# Altium project Invertor 24-380V.PrjPcb
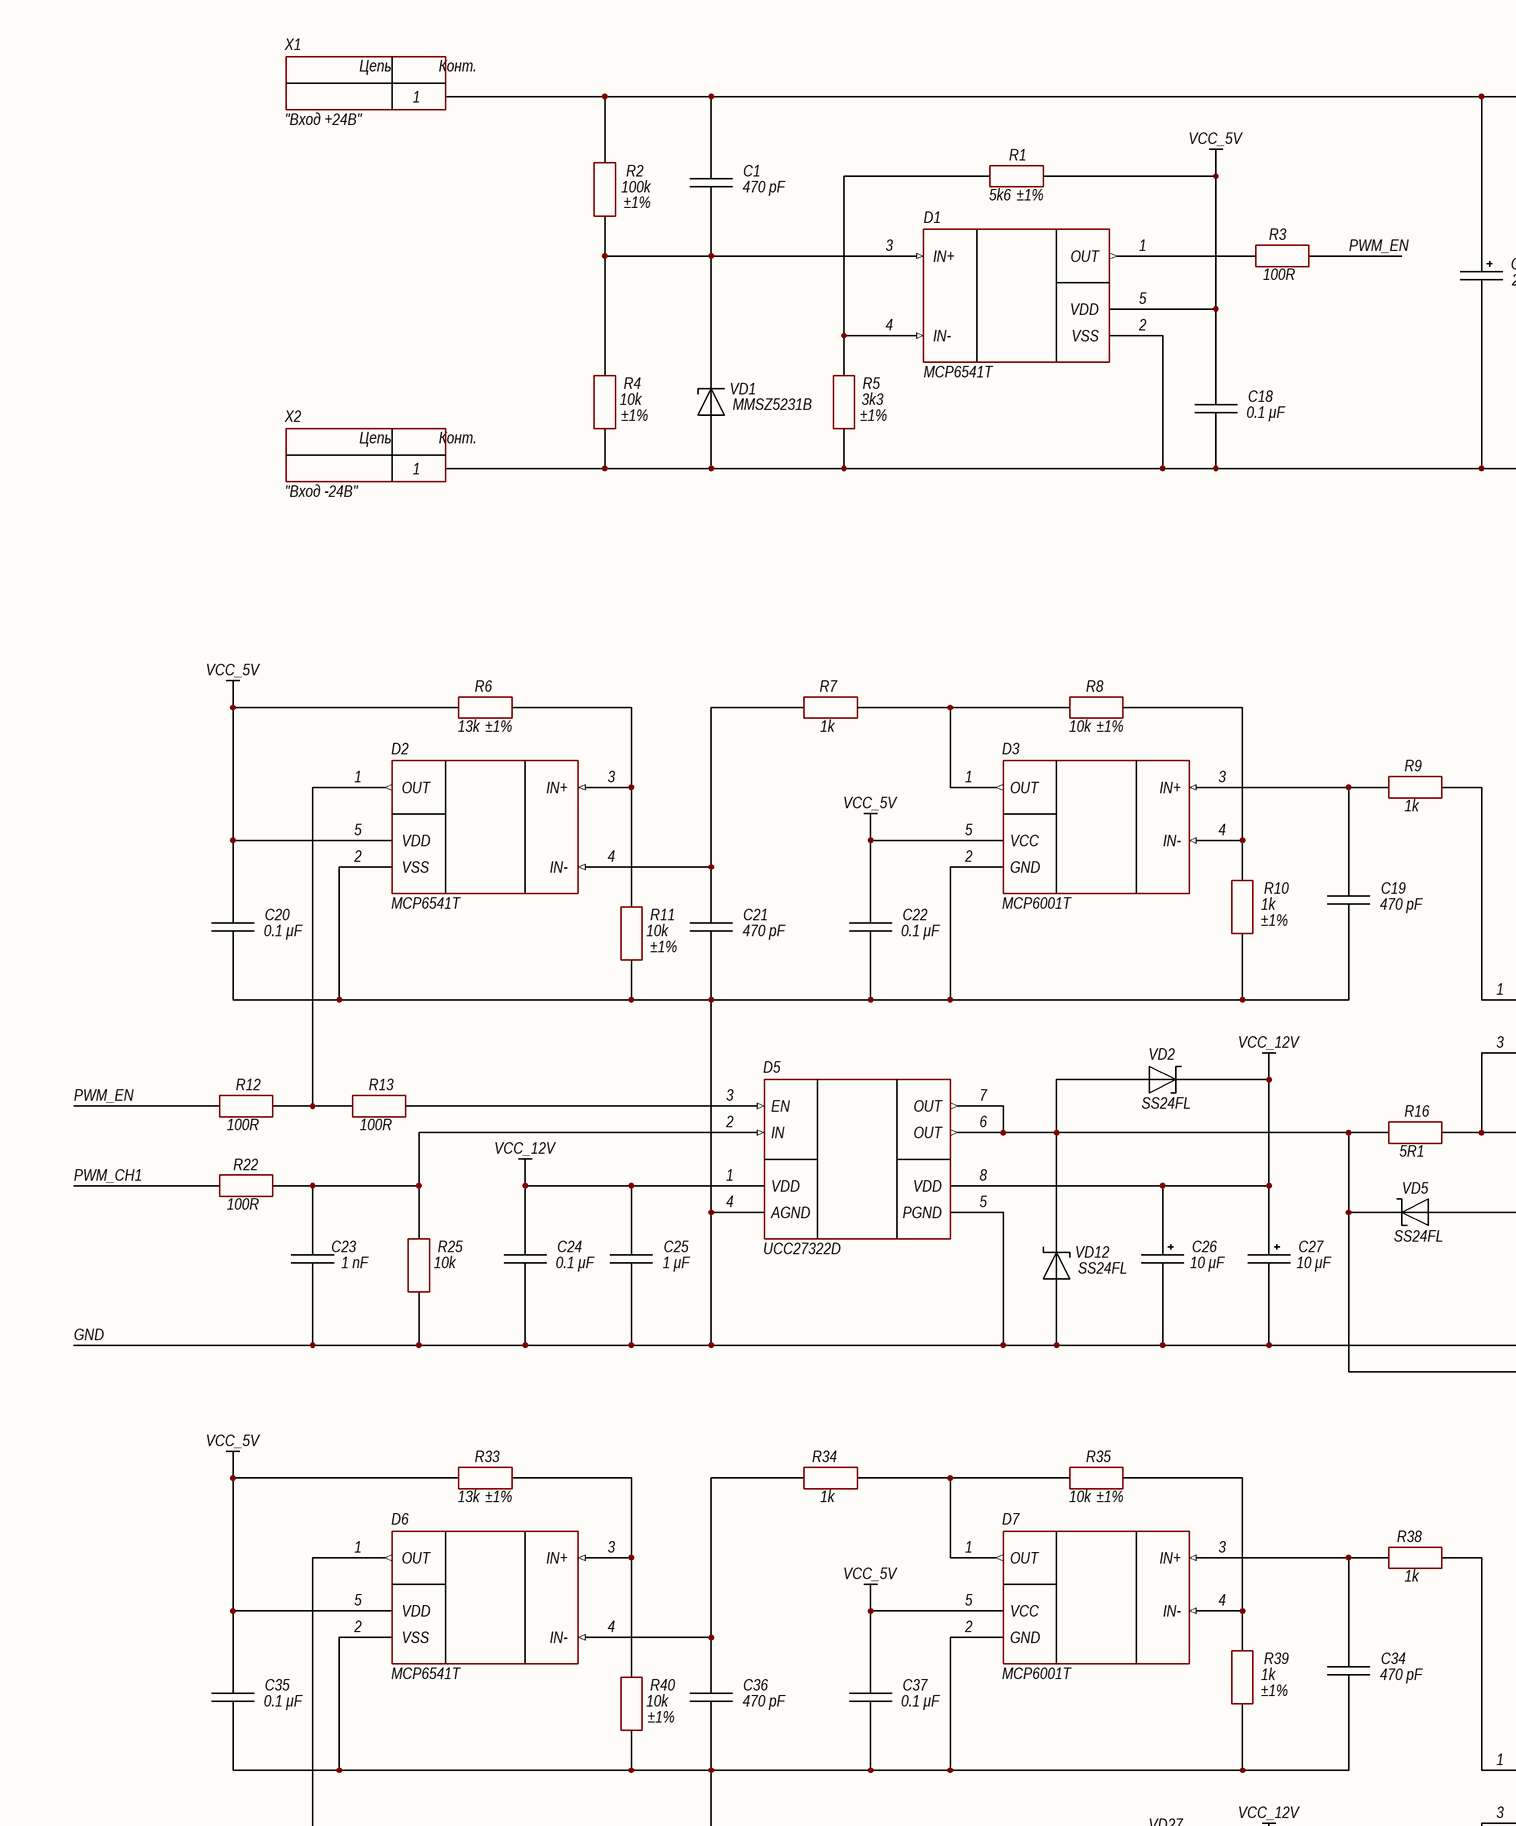
[diagram p0: Page 1.SchDoc, top left]
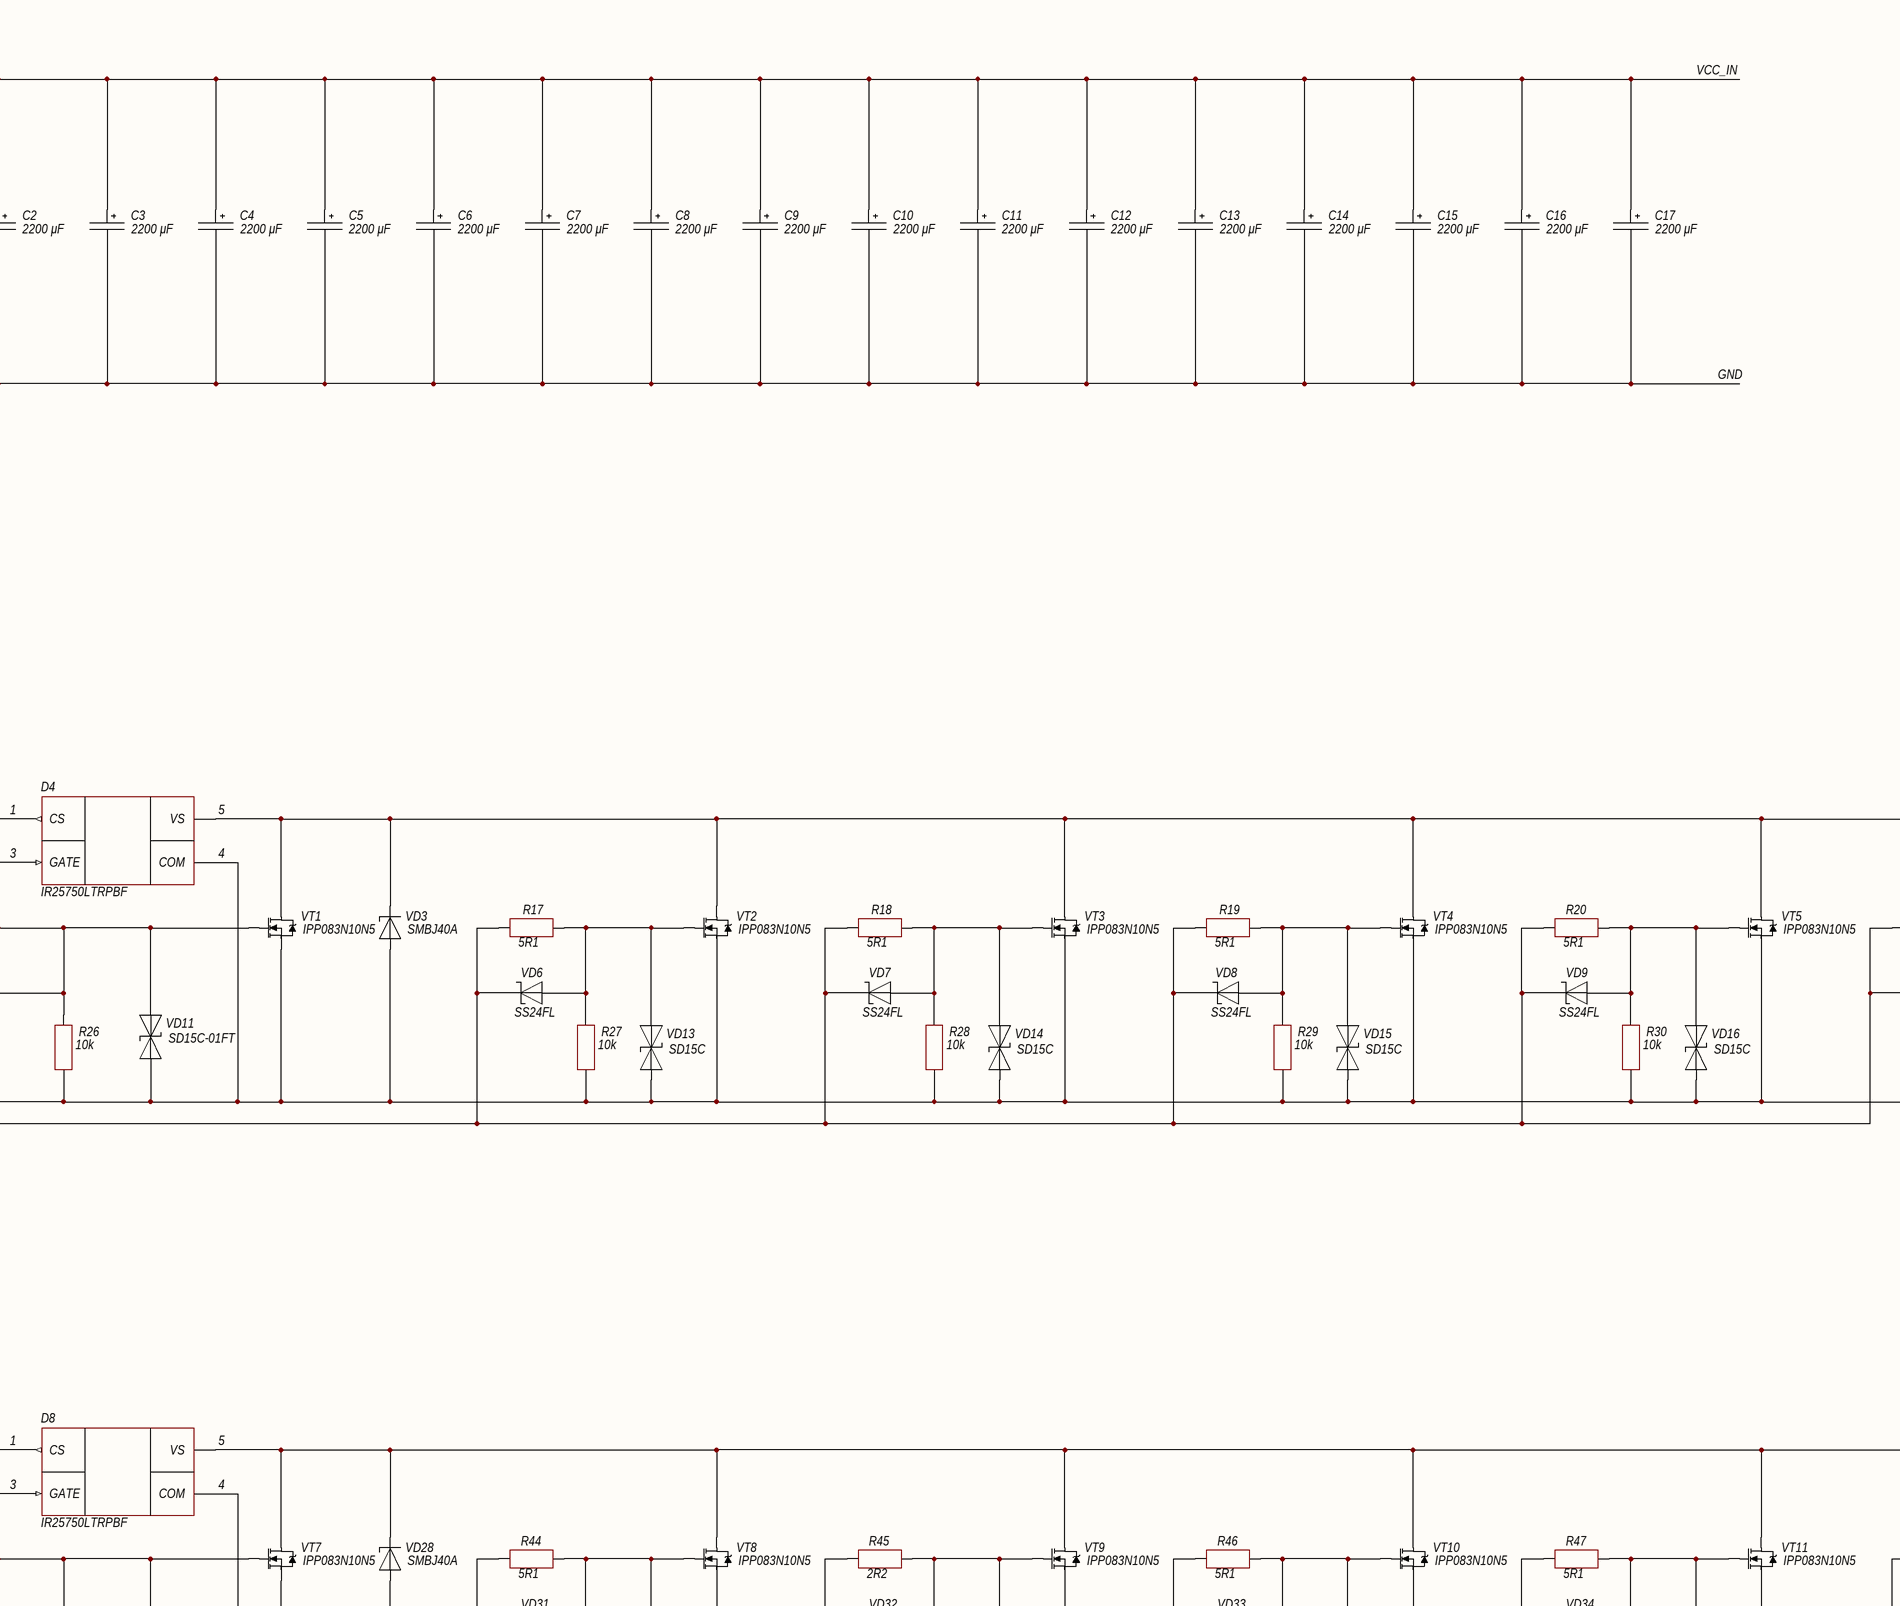
[diagram p1: Page 1.SchDoc, top middle]
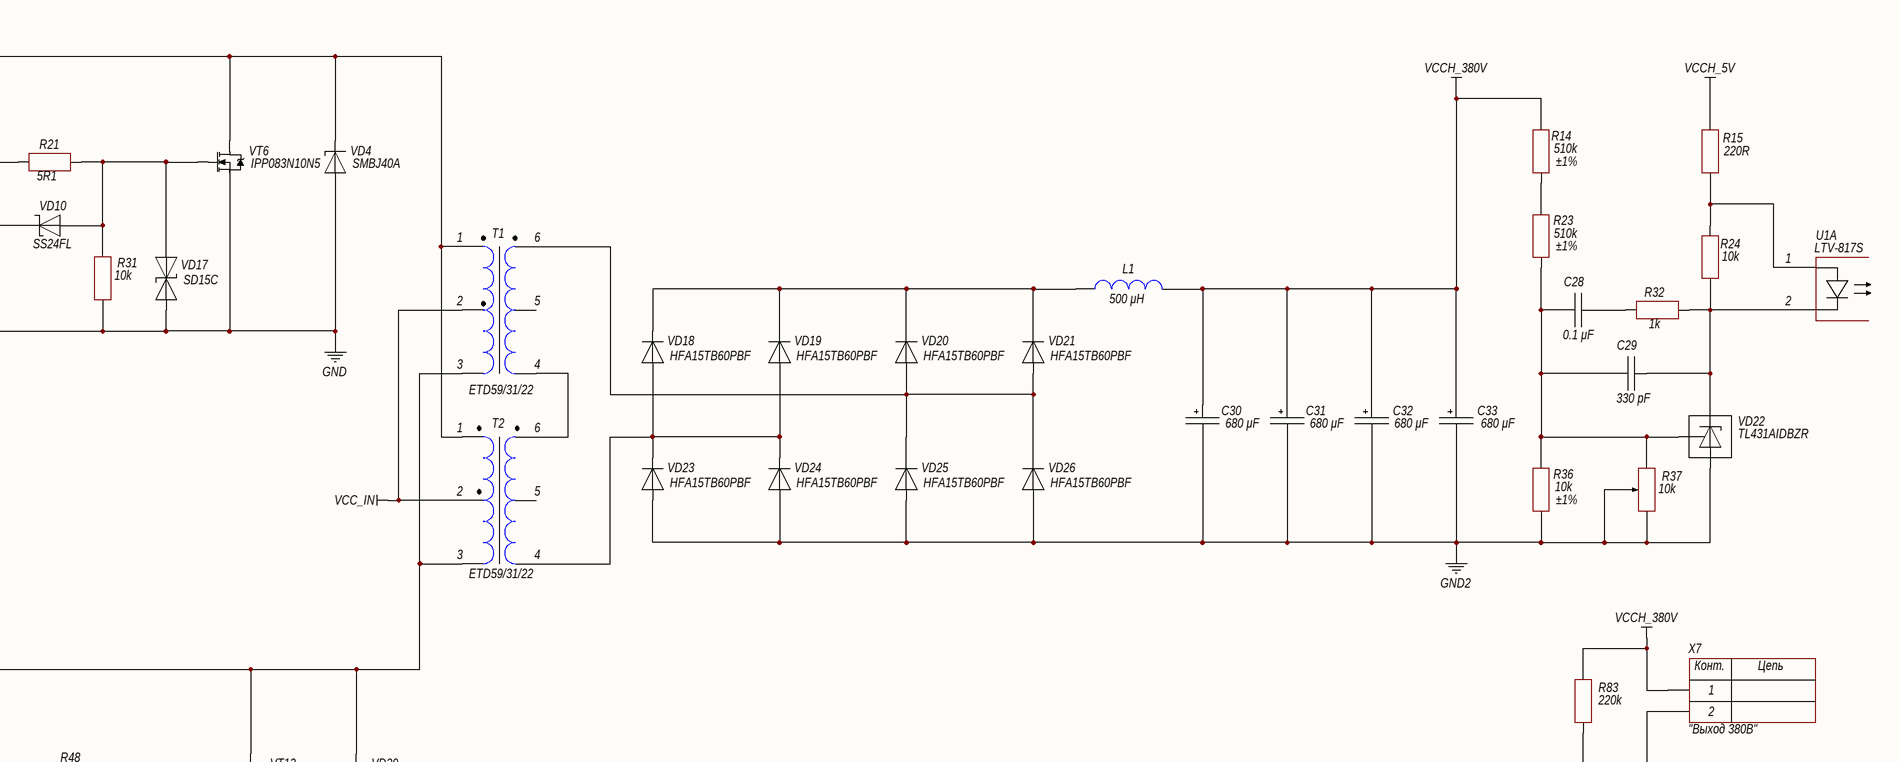
[diagram p2: Page 1.SchDoc, top right]
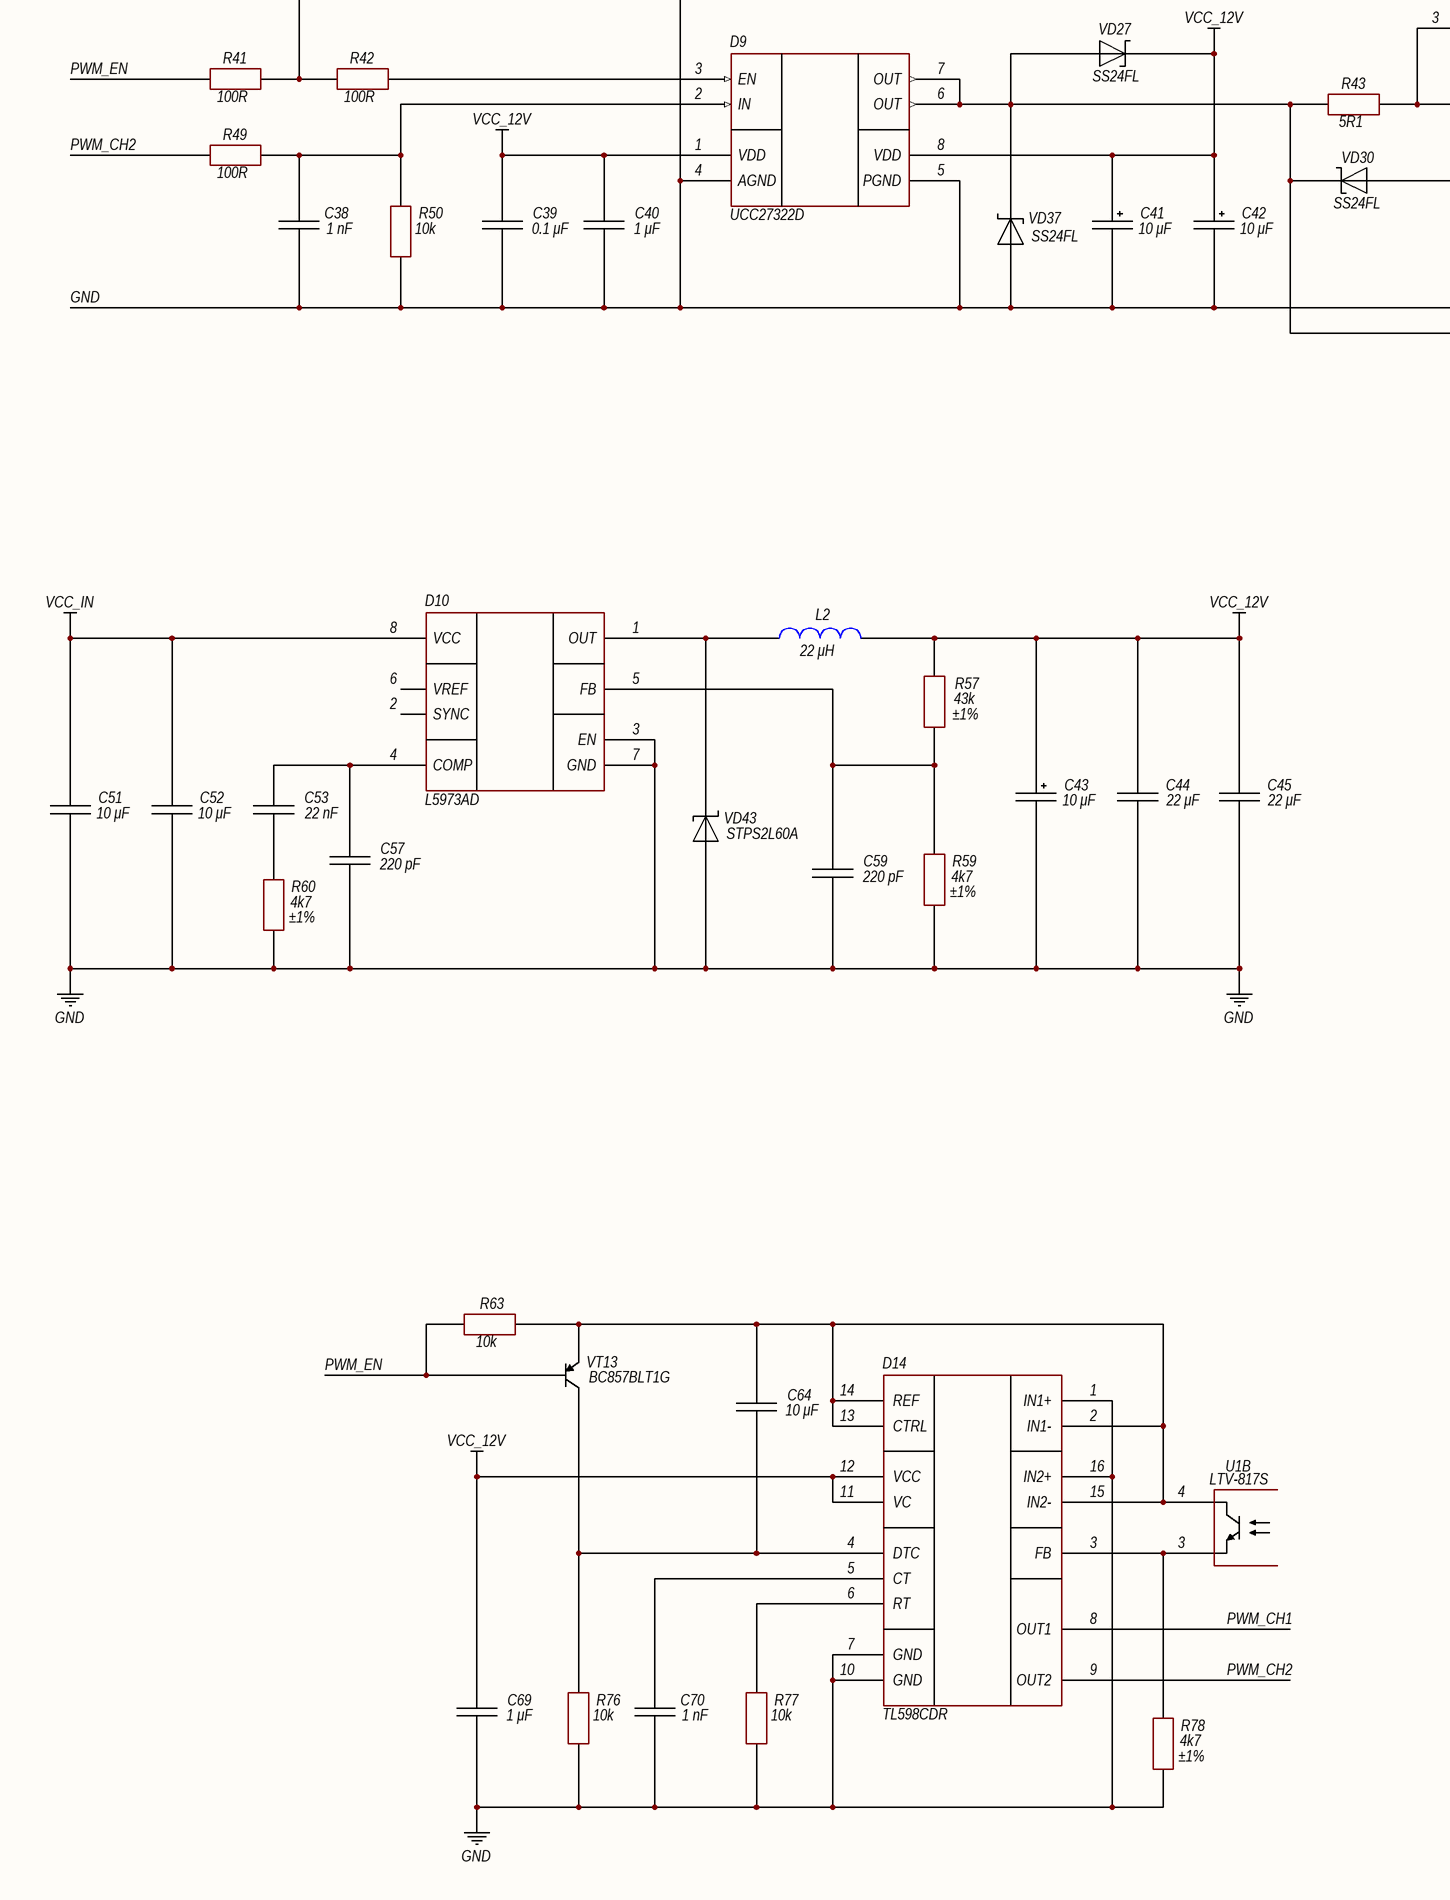
[diagram p3: Page 1.SchDoc, bottom left]
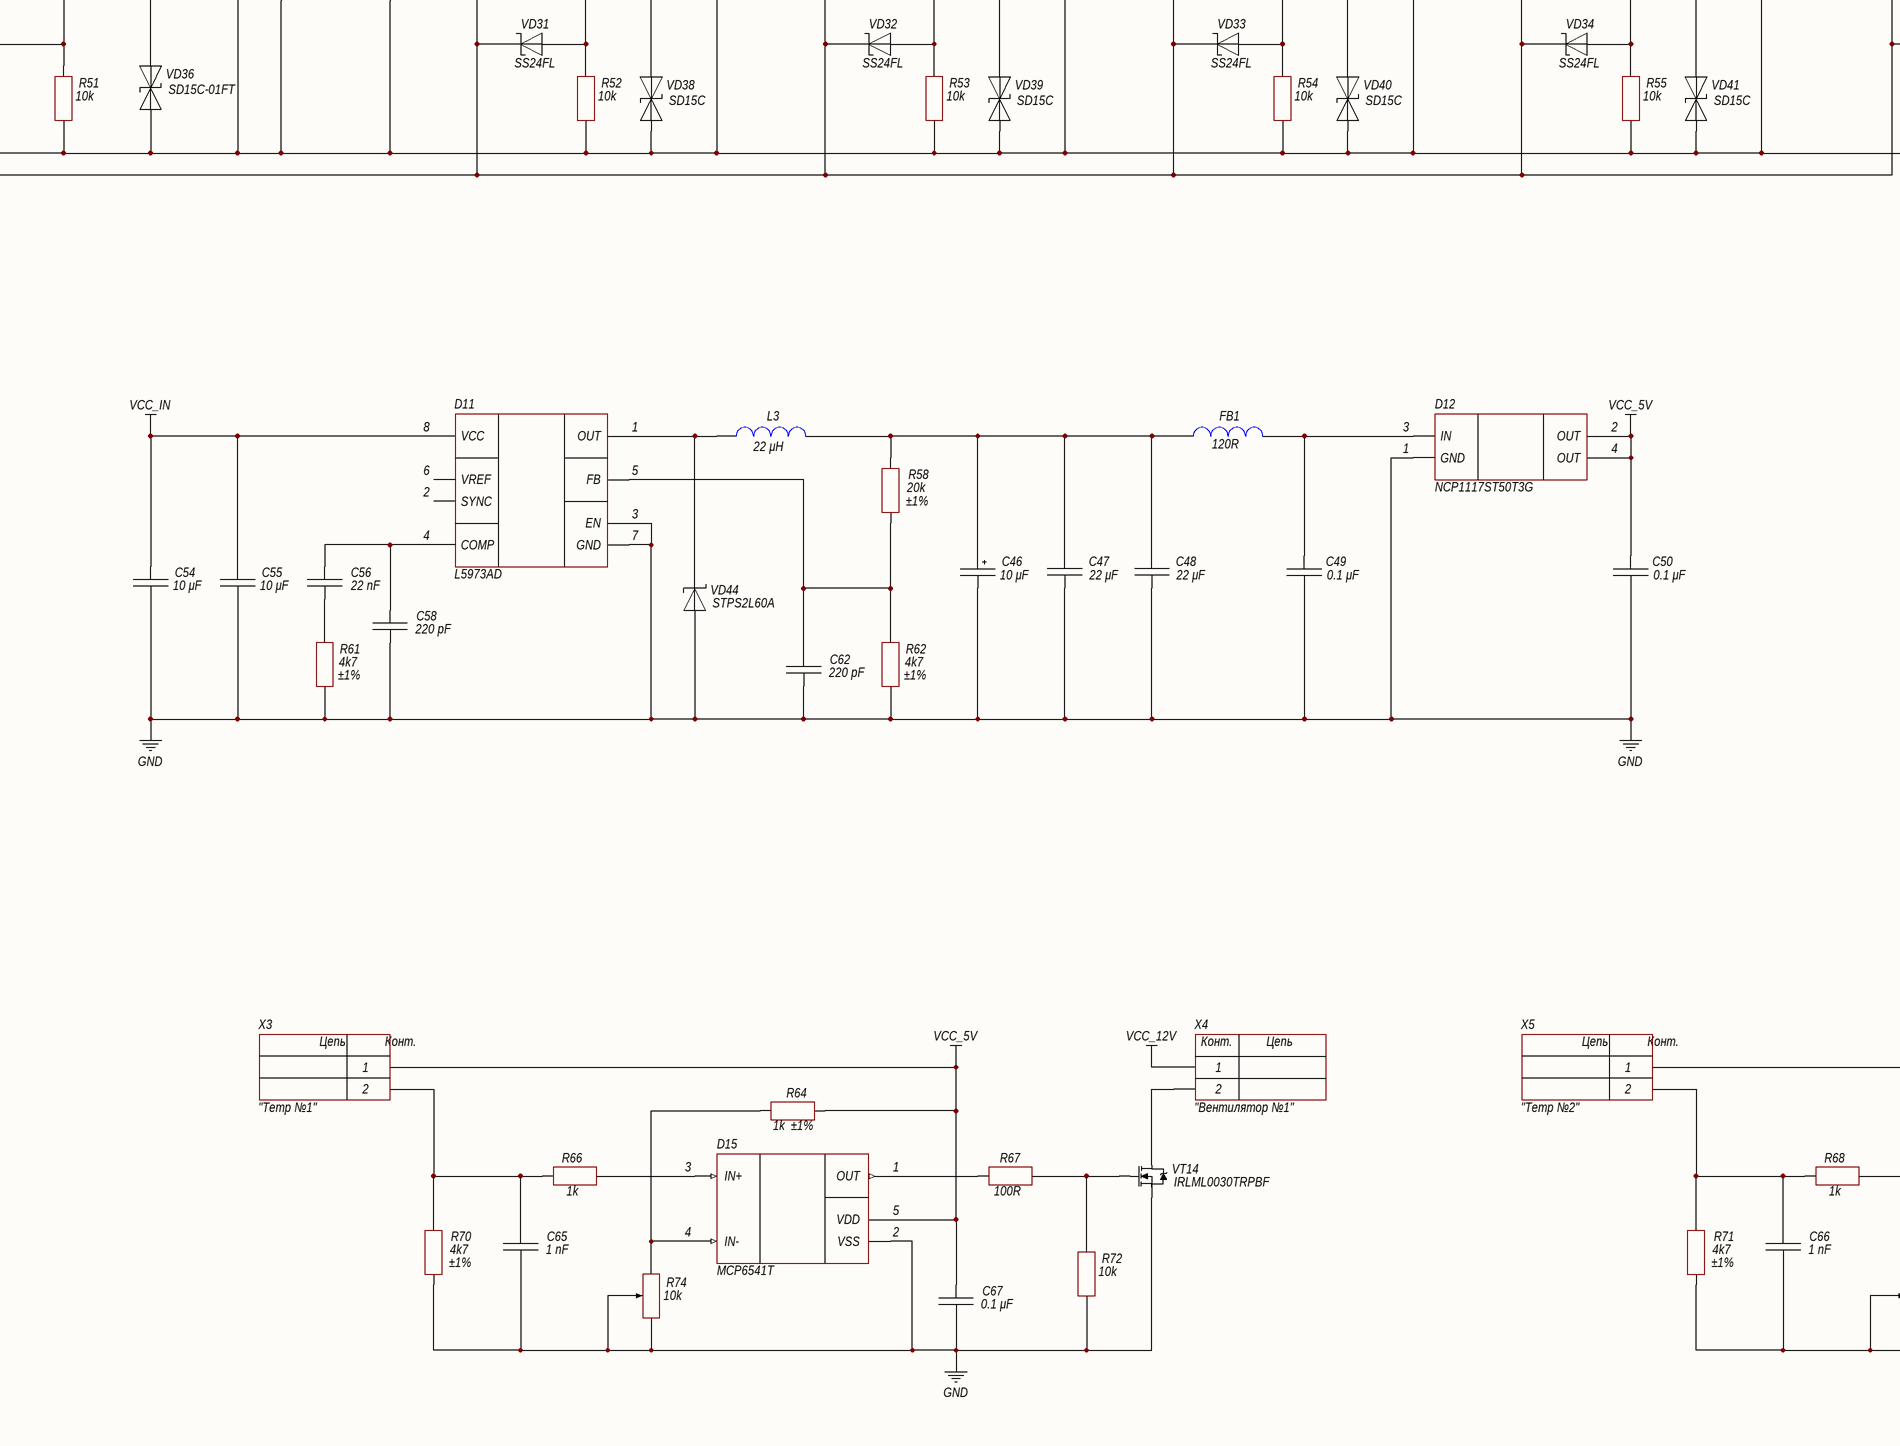
[diagram p4: Page 1.SchDoc, bottom middle]
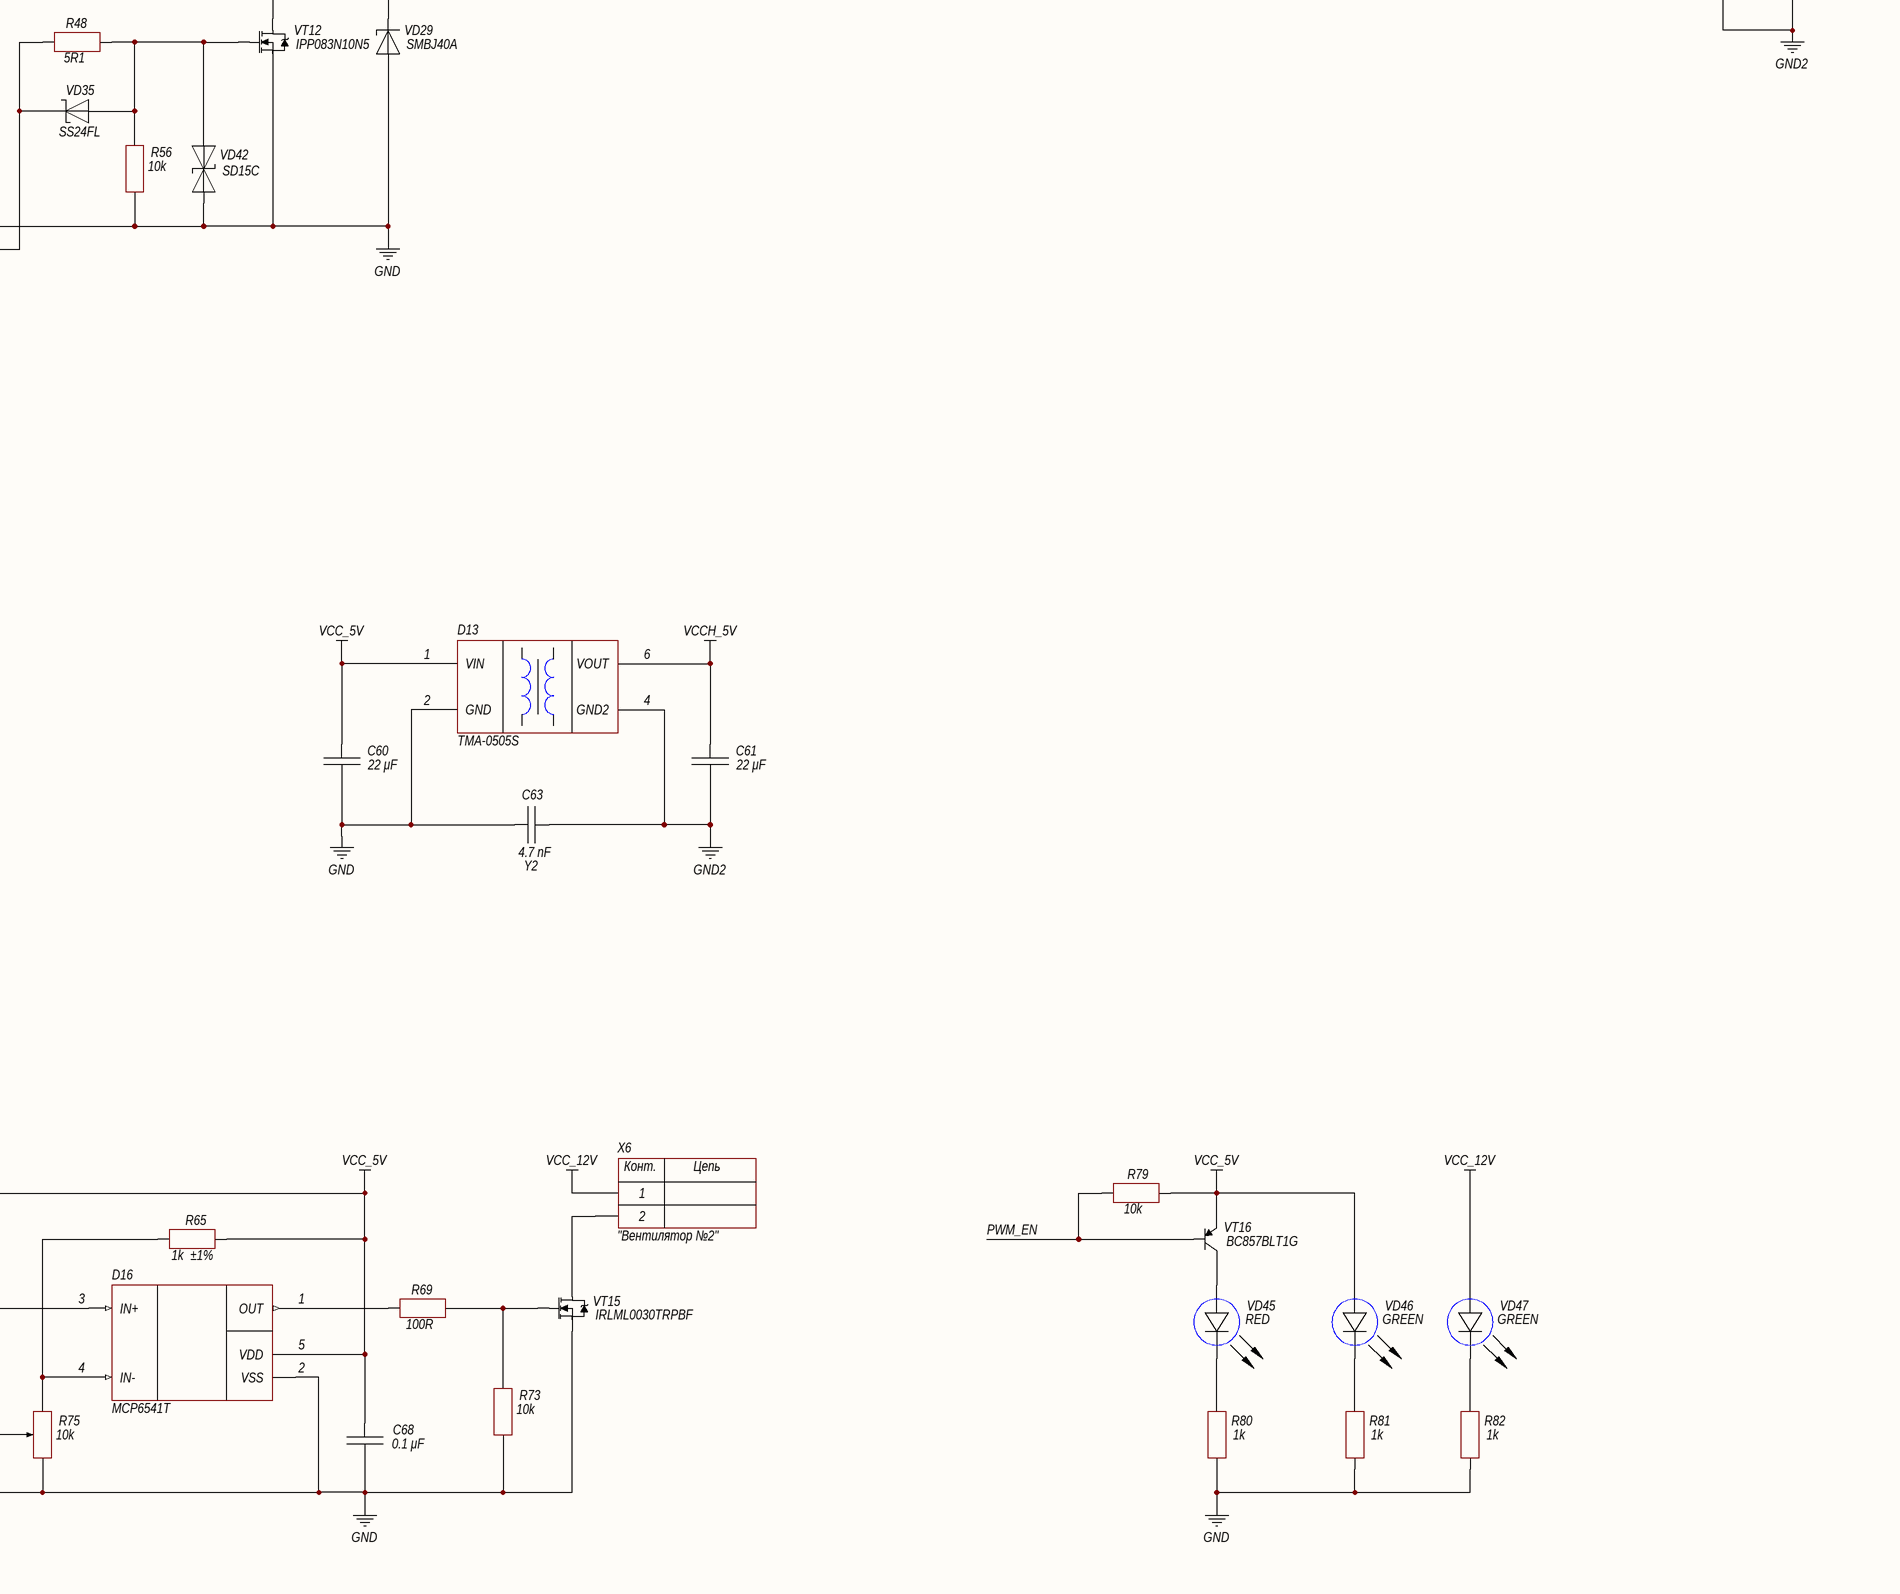
[diagram p5: Page 1.SchDoc, bottom right]
1 sheet, 246 parts. Net scope: global (net labels, ports and power ports of the same name join across sheets).
Board file: PCB for invertor.PcbDoc

## Sheet Page 1.SchDoc: Инвертор напряжения 24-380-230В
size 1188 x 840 mm; CompanyName: Nordic Energy; Address1: Address1; Address2: Address2; Address3: Address3; Address4: Address4; DocumentNumber: НЭС.185014.2017-5.1; SheetNumber: 1; SheetTotal: 3; Scale: 1:1; Title2str: номинальной мощностью 2000 Вт; DocumentType: Схема электрическая принципиальная; FirstReferrence: НЭС.185014.2017-5.1

### Parts
C1  470 pF  [CH0805C]
C2  2200 μF  [D16C7.5H25]
C3  2200 μF  [D16C7.5H25]
C4  2200 μF  [D16C7.5H25]
C5  2200 μF  [D16C7.5H25]
C6  2200 μF  [D16C7.5H25]
C7  2200 μF  [D16C7.5H25]
C8  2200 μF  [D16C7.5H25]
C9  2200 μF  [D16C7.5H25]
C10  2200 μF  [D16C7.5H25]
C11  2200 μF  [D16C7.5H25]
C12  2200 μF  [D16C7.5H25]
C13  2200 μF  [D16C7.5H25]
C14  2200 μF  [D16C7.5H25]
C15  2200 μF  [D16C7.5H25]
C16  2200 μF  [D16C7.5H25]
C17  2200 μF  [D16C7.5H25]
C18  0.1 μF  [CH0805C]
C19  470 pF  [CH0805C]
C20  0.1 μF  [CH0805C]
C21  470 pF  [CH0805C]
C22  0.1 μF  [CH0805C]
C23  1 nF  [CH0805C]
C24  0.1 μF  [CH0805C]
C25  1 μF  [CH0805C]
C26  10 μF  [TANTAL_C]
C27  10 μF  [TANTAL_C]
C28  0.1 μF  [CH0805C]
C29  330 pF  [CH0805C]
C30  680 μF  [D35C10.5H50]
C31  680 μF  [D35C10.5H50]
C32  680 μF  [D35C10.5H50]
C33  680 μF  [D35C10.5H50]
C34  470 pF  [CH0805C]
C35  0.1 μF  [CH0805C]
C36  470 pF  [CH0805C]
C37  0.1 μF  [CH0805C]
C38  1 nF  [CH0805C]
C39  0.1 μF  [CH0805C]
C40  1 μF  [CH0805C]
C41  10 μF  [TANTAL_C]
C42  10 μF  [TANTAL_C]
C43  10 μF  [TANTAL_C]
C44  22 μF  [CH1206C]
C45  22 μF  [CH1206C]
C46  10 μF  [TANTAL_C]
C47  22 μF  [CH1206C]
C48  22 μF  [CH1206C]
C49  0.1 μF  [CH0805C]
C50  0.1 μF  [CH0805C]
C51  10 μF  [CH1206C]
C52  10 μF  [CH1206C]
C53  22 nF  [CH0805C]
C54  10 μF  [CH1206C]
C55  10 μF  [CH1206C]
C56  22 nF  [CH0805C]
C57  220 pF  [CH0805C]
C58  220 pF  [CH0805C]
C59  220 pF  [CH0805C]
C60  22 μF  [CH1206C]
C61  22 μF  [CH1206C]
C62  220 pF  [CH0805C]
C63  4.7 nF  ComponentKind: Y2  [CAP: B32021]
C64  10 μF  [CH0805C]
C65  1 nF  [CH0805C]
C66  1 nF  [CH0805C]
C67  0.1 μF  [CH0805C]
C68  0.1 μF  [CH0805C]
C69  1 μF  [CH0805C]
C70  1 nF  [CH0805C]
D1  MCP6541T  [SOT23-5]
D2  MCP6541T  [SOT23-5]
D3  MCP6001T  [SOT23-5]
D4  IR25750LTRPBF  [SOT23-5]
D5  UCC27322D  [8-SOIC]
D6  MCP6541T  [SOT23-5]
D7  MCP6001T  [SOT23-5]
D8  IR25750LTRPBF  [SOT23-5]
D9  UCC27322D  [8-SOIC]
D10  L5973AD  [8-SOIC (PAD)]
D11  L5973AD  [8-SOIC (PAD)]
D12  NCP1117ST50T3G  [SOT223]
D13  TMA-0505S  [MOD: TMA-0505S]
D14  TL598CDR  [16-SOIC]
D15  MCP6541T  [SOT23-5]
D16  MCP6541T  [SOT23-5]
FB1  120R  [CH0805L]
L1  500 μH  [IND: R46]
L2  22 μH  [IND: SDR0604]
L3  22 μH  [IND: SDR0604]
R1  5k6  ComponentKind: ±1%  [CH0805R]
R2  100k  ComponentKind: ±1%  [CH0805R]
R3  100R  [CH0805R]
R4  10k  ComponentKind: ±1%  [CH0805R]
R5  3k3  ComponentKind: ±1%  [CH0805R]
R6  13k  ComponentKind: ±1%  [CH0805R]
R7  1k  [CH0805R]
R8  10k  ComponentKind: ±1%  [CH0805R]
R9  1k  [CH0805R]
R10  1k  ComponentKind: ±1%  [CH0805R]
R11  10k  ComponentKind: ±1%  [CH0805R]
R12  100R  [CH0805R]
R13  100R  [CH0805R]
R14  510k  ComponentKind: ±1%  [CH0805R]
R15  220R  [CH0805R]
R16  5R1  [CH0805R]
R17  5R1  [CH0805R]
R18  5R1  [CH0805R]
R19  5R1  [CH0805R]
R20  5R1  [CH0805R]
R21  5R1  [CH0805R]
R22  100R  [CH0805R]
R23  510k  ComponentKind: ±1%  [CH0805R]
R24  10k  [CH0805R]
R25  10k  [CH0805R]
R26  10k  [CH0805R]
R27  10k  [CH0805R]
R28  10k  [CH0805R]
R29  10k  [CH0805R]
R30  10k  [CH0805R]
R31  10k  [CH0805R]
R32  1k  [CH0805R]
R33  13k  ComponentKind: ±1%  [CH0805R]
R34  1k  [CH0805R]
R35  10k  ComponentKind: ±1%  [CH0805R]
R36  10k  ComponentKind: ±1%  [CH0805R]
R37  10k  [RES: 3296W]
R38  1k  [CH0805R]
R39  1k  ComponentKind: ±1%  [CH0805R]
R40  10k  ComponentKind: ±1%  [CH0805R]
R41  100R  [CH0805R]
R42  100R  [CH0805R]
R43  5R1  [CH0805R]
R44  5R1  [CH0805R]
R45  2R2  [CH0805R]
R46  5R1  [CH0805R]
R47  5R1  [CH0805R]
R48  5R1  [CH0805R]
R49  100R  [CH0805R]
R50  10k  [CH0805R]
R51  10k  [CH0805R]
R52  10k  [CH0805R]
R53  10k  [CH0805R]
R54  10k  [CH0805R]
R55  10k  [CH0805R]
R56  10k  [CH0805R]
R57  43k  ComponentKind: ±1%  [CH0805R]
R58  20k  ComponentKind: ±1%  [CH0805R]
R59  4k7  ComponentKind: ±1%  [CH0805R]
R60  4k7  ComponentKind: ±1%  [CH0805R]
R61  4k7  ComponentKind: ±1%  [CH0805R]
R62  4k7  ComponentKind: ±1%  [CH0805R]
R63  10k  [CH0805R]
R64  1k  ComponentKind: ±1%  [CH0805R]
R65  1k  ComponentKind: ±1%  [CH0805R]
R66  1k  [CH0805R]
R67  100R  [CH0805R]
R68  1k  [CH0805R]
R69  100R  [CH0805R]
R70  4k7  ComponentKind: ±1%  [CH0805R]
R71  4k7  ComponentKind: ±1%  [CH0805R]
R72  10k  [CH0805R]
R73  10k  [CH0805R]
R74  10k  [RES: 3296W]
R75  10k  [RES: 3296W]
R76  10k  [CH0805R]
R77  10k  [CH0805R]
R78  4k7  ComponentKind: ±1%  [CH0805R]
R79  10k  [CH0805R]
R80  1k  [CH0805R]
R81  1k  [CH0805R]
R82  1k  [CH0805R]
R83  220k  [CH2512R]
T1  ETD59/31/22  [TRANS: ETD59/31/22]
T2  ETD59/31/22  [TRANS: ETD59/31/22]
U1  LTV-817S  [4-SMD]  (parts A,B of 2)
VD1  MMSZ5231B  [SOD123]
VD2  SS24FL  [SOD123F]
VD3  SMBJ40A  [SMB]
VD4  SMBJ40A  [SMB]
VD5  SS24FL  [SOD123F]
VD6  SS24FL  [SOD123F]
VD7  SS24FL  [SOD123F]
VD8  SS24FL  [SOD123F]
VD9  SS24FL  [SOD123F]
VD10  SS24FL  [SOD123F]
VD11  SD15C-01FT  [SOD323]
VD12  SS24FL  [SOD123F]
VD13  SD15C  [SOD323]
VD14  SD15C  [SOD323]
VD15  SD15C  [SOD323]
VD16  SD15C  [SOD323]
VD17  SD15C  [SOD323]
VD18  HFA15TB60PBF  [TO220-2]
VD19  HFA15TB60PBF  [TO220-2]
VD20  HFA15TB60PBF  [TO220-2]
VD21  HFA15TB60PBF  [TO220-2]
VD22  TL431AIDBZR  [SOT23_132]
VD23  HFA15TB60PBF  [TO220-2]
VD24  HFA15TB60PBF  [TO220-2]
VD25  HFA15TB60PBF  [TO220-2]
VD26  HFA15TB60PBF  [TO220-2]
VD27  SS24FL  [SOD123F]
VD28  SMBJ40A  [SMB]
VD29  SMBJ40A  [SMB]
VD30  SS24FL  [SOD123F]
VD31  SS24FL  [SOD123F]
VD32  SS24FL  [SOD123F]
VD33  SS24FL  [SOD123F]
VD34  SS24FL  [SOD123F]
VD35  SS24FL  [SOD123F]
VD36  SD15C-01FT  [SOD323]
VD37  SS24FL  [SOD123F]
VD38  SD15C  [SOD323]
VD39  SD15C  [SOD323]
VD40  SD15C  [SOD323]
VD41  SD15C  [SOD323]
VD42  SD15C  [SOD323]
VD43  STPS2L60A  [SMA]
VD44  STPS2L60A  [SMA]
VD45  RED  [CH0805LR]
VD46  GREEN  [CH0805LR]
VD47  GREEN  [CH0805LR]
VT1  IPP083N10N5  [TO220_123]
VT2  IPP083N10N5  [TO220_123]
VT3  IPP083N10N5  [TO220_123]
VT4  IPP083N10N5  [TO220_123]
VT5  IPP083N10N5  [TO220_123]
VT6  IPP083N10N5  [TO220_123]
VT7  IPP083N10N5  [TO220_123]
VT8  IPP083N10N5  [TO220_123]
VT9  IPP083N10N5  [TO220_123]
VT10  IPP083N10N5  [TO220_123]
VT11  IPP083N10N5  [TO220_123]
VT12  IPP083N10N5  [TO220_123]
VT13  BC857BLT1G  [SOT23_132]
VT14  IRLML0030TRPBF  [SOT23_123]
VT15  IRLML0030TRPBF  [SOT23_123]
VT16  BC857BLT1G  [SOT23_132]
X1  "Вход +24В"  [CON: 7461383]
X2  "Вход -24В"  [CON: 7461383]
X3  "Temp №1"  [CON: WF-02]
X4  "Вентилятор №1"  [CON: WF-02]
X5  "Temp №2"  [CON: WF-02]
X6  "Вентилятор №2"  [CON: WF-02]
X7  "Выход 380В"  [CON: X977B02]

### Nets
GND: C2.2 C3.2 C4.2 C5.2 C6.2 C7.2 C8.2 C9.2 C10.2 C11.2 C12.2 C13.2 C14.2 C15.2 C16.2 C17.2 C18.1 C19.2 C20.1 C21.2 C22.1 C23.1 C24.1 C25.1 C26.2 C27.2 C34.2 C35.1 C36.2 C37.1 C38.1 C39.1 C40.1 C41.2 C42.2 C43.2 C44.1 C45.1 C46.2 C47.1 C48.1 C49.1 C50.1 C51.1 C52.1 C54.1 C55.1 C57.1 C58.1 C59.1 C60.1 C62.1 C63.1 C65.1 C66.1 C67.1 C68.1 C69.1 C70.1 D1.2(VSS) D2.2(VSS) D3.2(GND) D4.4(COM) D5.4(AGND) D5.5(PGND) D6.2(VSS) D7.2(GND) D8.4(COM) D9.4(AGND) D9.5(PGND) D10.3(EN) D10.7(GND) D11.3(EN) D11.7(GND) D12.1(GND) D13.2(GND) D14.1(IN1+) D14.7(GND) D14.10(GND) D14.16(IN2+) D15.2(VSS) D16.2(VSS) R4.2 R5.2 R10.2 R11.2 R25.1 R26.1 R27.1 R28.1 R29.1 R30.1 R31.1 R39.2 R40.2 R50.1 R51.1 R52.1 R53.1 R54.1 R55.1 R56.1 R59.1 R60.1 R61.1 R62.1 R70.1 R71.1 R72.1 R73.1 R74.1 R74.2 R75.1 R75.2 R76.1 R77.1 R78.1 R80.2 R81.2 R82.2 VD1.1(A) VD3.1(A) VD4.1(A) VD11.1(A) VD12.1 VD13.1(A) VD14.1(A) VD15.1(A) VD16.1(A) VD17.1(A) VD28.1(A) VD29.1(A) VD36.1(A) VD37.1 VD38.1(A) VD39.1(A) VD40.1(A) VD41.1(A) VD42.1(A) VD43.1 VD44.1 VT1.3(S) VT2.3(S) VT3.3(S) VT4.3(S) VT5.3(S) VT6.3(S) VT7.3(S) VT8.3(S) VT9.3(S) VT10.3(S) VT11.3(S) VT12.3(S) VT14.3(S) VT15.3(S) X2.1
GND2: C30.2 C31.2 C32.2 C33.2 C61.1 C63.2 D13.4(GND2) R36.2 R37.1 R37.2 R83.2 VD22.3 VD23.1 VD24.1 VD25.1 VD26.1 X7.2
VCC_5V: C18.2 C20.2 C22.2 C35.2 C37.2 C50.2 C60.2 C67.2 C68.2 D1.5(VDD) D2.5(VDD) D3.5(VCC) D6.5(VDD) D7.5(VCC) D12.2(OUT) D12.4(OUT) D13.1(VIN) D15.5(VDD) D16.5(VDD) R1.2 R6.2 R33.2 R64.2 R65.2 R79.1 VD46.1(A) VT16.2(E) X3.1 X5.1
VCC_12V: C24.2 C25.2 C26.1 C27.1 C39.2 C40.2 C41.1 C42.1 C43.1 C44.2 C45.2 C69.2 D5.1(VDD) D5.8(VDD) D9.1(VDD) D9.8(VDD) D14.11(VC) D14.12(VCC) L2.1 R57.1 VD2.2 VD27.2 VD47.1(A) X4.1 X6.1
VCC_IN: C1.1 C2.1 C3.1 C4.1 C5.1 C6.1 C7.1 C8.1 C9.1 C10.1 C11.1 C12.1 C13.1 C14.1 C15.1 C16.1 C17.1 C51.2 C52.2 C54.2 C55.2 D10.8(VCC) D11.8(VCC) R2.1 T1.2 T2.2 X1.1
VCCH_5V: C61.2 D13.6(VOUT) R15.2
VCCH_380V: C30.1 C31.1 C32.1 C33.1 L1.2 R14.1 R83.1 X7.1
PWM_CH1: D14.8(OUT1) R22.2
PWM_CH2: D14.9(OUT2) R49.2
PWM_EN: R3.1 R12.2 R41.2 R63.2 R79.2 VT13.1(B) VT16.1(B)
NetC1_2: C1.2 D1.3(IN+) R2.2 R4.1 VD1.2(C)
NetC19_1: C19.1 D3.3(IN+) R9.2
NetC21_1: C21.1 D2.4(IN-) R7.2
NetC23_2: C23.2 D5.2(IN) R22.1 R25.2
NetC28_1: C28.1 C29.1 R23.2 R36.1 R37.3 VD22.2
NetC28_2: C28.2 R32.2
NetC29_2: C29.2 R24.1 R32.1 U1.2(C) VD22.1
NetC34_1: C34.1 D7.3(IN+) R38.2
NetC36_1: C36.1 D6.4(IN-) R34.2
NetC38_2: C38.2 D9.2(IN) R49.1 R50.2
NetC46_1: C46.1 C47.2 C48.2 FB1.2 L3.1 R58.1
NetC49_2: C49.2 D12.3(IN) FB1.1
NetC53_1: C53.1 R60.2
NetC53_2: C53.2 C57.2 D10.4(COMP)
NetC56_1: C56.1 R61.2
NetC56_2: C56.2 C58.2 D11.4(COMP)
NetC59_2: C59.2 D10.5(FB) R57.2 R59.2
NetC62_2: C62.2 D11.5(FB) R58.2 R62.2
NetC64_1: C64.1 D14.4(DTC) R76.2 VT13.3(C)
NetC64_2: C64.2 D14.2(IN1-) D14.13(CTRL) D14.14(REF) D14.15(IN2-) R63.1 U1.4(C) VT13.2(E)
NetC65_2: C65.2 R66.2 R70.2 X3.2
NetC66_2: C66.2 R68.2 R71.2 X5.2
NetC70_2: C70.2 D14.5(CT)
NetD1_1: D1.1(OUT) R3.2
NetD1_4: D1.4(IN-) R1.1 R5.1
NetD2_1: D2.1(OUT) R12.1 R13.2
NetD2_3: D2.3(IN+) R6.1 R11.1
NetD3_1: D3.1(OUT) R7.1 R8.2
NetD3_4: D3.4(IN-) R8.1 R10.1
NetD4_1: D4.1(CS) R9.1
NetD4_3: D4.3(GATE) R16.1 R26.2 VD5.1 VD11.2(C) VT1.1(G)
NetD4_5: D4.5(VS) T1.1 T2.1 VD3.2(C) VD4.2(C) VT1.2(D) VT2.2(D) VT3.2(D) VT4.2(D) VT5.2(D) VT6.2(D)
NetD5_3: D5.3(EN) R13.1
NetD5_6: D5.6(OUT) D5.7(OUT) R16.2 R17.2 R18.2 R19.2 R20.2 R21.2 VD2.1 VD5.2 VD6.2 VD7.2 VD8.2 VD9.2 VD10.2 VD12.2
NetD6_1: D6.1(OUT) R41.1 R42.2
NetD6_3: D6.3(IN+) R33.1 R40.1
NetD7_1: D7.1(OUT) R34.1 R35.2
NetD7_4: D7.4(IN-) R35.1 R39.1
NetD8_1: D8.1(CS) R38.1
NetD8_3: D8.3(GATE) R43.1 R51.2 VD30.1 VD36.2(C) VT7.1(G)
NetD8_5: D8.5(VS) T1.3 T2.3 VD28.2(C) VD29.2(C) VT7.2(D) VT8.2(D) VT9.2(D) VT10.2(D) VT11.2(D) VT12.2(D)
NetD9_3: D9.3(EN) R42.1
NetD9_6: D9.6(OUT) D9.7(OUT) R43.2 R44.2 R45.2 R46.2 R47.2 R48.2 VD27.1 VD30.2 VD31.2 VD32.2 VD33.2 VD34.2 VD35.2 VD37.2
NetD10_1: D10.1(OUT) L2.2 VD43.2
NetD11_1: D11.1(OUT) L3.2 VD44.2
NetD14_3: D14.3(FB) R78.2 U1.3(E)
NetD14_6: D14.6(RT) R77.2
NetD15_1: D15.1(OUT) R67.2
NetD15_3: D15.3(IN+) R66.1
NetD15_4: D15.4(IN-) R64.1 R74.3
NetD16_1: D16.1(OUT) R69.2
NetD16_3: D16.3(IN+) R68.1
NetD16_4: D16.4(IN-) R65.1 R75.3
NetL1_1: L1.1 VD18.2 VD19.2 VD20.2 VD21.2
NetR14_2: R14.2 R23.1
NetR15_1: R15.1 R24.2 U1.1(A)
NetR17_1: R17.1 R27.2 VD6.1 VD13.2(C) VT2.1(G)
NetR18_1: R18.1 R28.2 VD7.1 VD14.2(C) VT3.1(G)
NetR19_1: R19.1 R29.2 VD8.1 VD15.2(C) VT4.1(G)
NetR20_1: R20.1 R30.2 VD9.1 VD16.2(C) VT5.1(G)
NetR21_1: R21.1 R31.2 VD10.1 VD17.2(C) VT6.1(G)
NetR44_1: R44.1 R52.2 VD31.1 VD38.2(C) VT8.1(G)
NetR45_1: R45.1 R53.2 VD32.1 VD39.2(C) VT9.1(G)
NetR46_1: R46.1 R54.2 VD33.1 VD40.2(C) VT10.1(G)
NetR47_1: R47.1 R55.2 VD34.1 VD41.2(C) VT11.1(G)
NetR48_1: R48.1 R56.2 VD35.1 VD42.2(C) VT12.1(G)
NetR67_1: R67.1 R72.2 VT14.1(G)
NetR69_1: R69.1 R73.2 VT15.1(G)
NetR80_1: R80.1 VD45.2(C)
NetR81_1: R81.1 VD46.2(C)
NetR82_1: R82.1 VD47.2(C)
NetT1_4: T1.4 T2.6
NetT1_6: T1.6 VD20.1 VD21.1 VD25.2 VD26.2
NetT2_4: T2.4 VD18.1 VD19.1 VD23.2 VD24.2
NetVD45_1: VD45.1(A) VT16.3(C)
NetVT14_2: VT14.2(D) X4.2
NetVT15_2: VT15.2(D) X6.2

Not connected (* = marked no-connect by the designer): D10 2(SYNC) 6(VREF); D11 2(SYNC) 6(VREF); T1 5; T2 5

### Notes on the sheet
- Перв. примен.
- Справ. №
- Подп. и дата
- Инв. № дубл.
- Взам. инв. №
- Разраб.
- Изм.
- Лист
- № докум.
- Подп.
- Дата
- Лит.
- Масса
- Масштаб
- Пров.
- Т.контр.
- Листов
- Инв. № подл.
- Утв.
- Н.контр.
- 2.106-A1
- Копировал
- Формат А0
- (in symbol 1-Connector) Цепь; Конт.
- (in symbol 2-Connector) Цепь; Конт.

### Library data of the parts
C1 C19 C21 C34 C36 = Capacitor: Manufacturer: Yageo; Model: CC0805KRX7R9BB471; HelpURL: https://www.digikey.com/product-detail/en/yageo/CC0805KRX7R9BB471/311-1124-1-ND/303034; ComponentKind: X7R; Value: 470 pF
C2-C17 = AlumCap: Manufacturer: Epcos; Model: B41851F7228M000; HelpURL: https://www.digikey.com/products/en?keywords=B41851F7228M000; ComponentKind: 35V; Value: 2200 μF
C18 C20 C22 C24 C28 C35 C37 C39 C49 C50 C67 C68 = Capacitor: Manufacturer: Yageo; Model: CC0805KRX7R8BB104; HelpURL: https://www.digikey.com/product-detail/en/yageo/CC0805KRX7R8BB104/311-1141-1-ND/303051; ComponentKind: X7R; Value: 0.1 μF
C23 C38 C65 C66 C70 = Capacitor: Manufacturer: Yageo; Model: CC0805KRX7R9BB102; HelpURL: https://www.digikey.com/product-detail/en/yageo/CC0805KRX7R9BB102/311-1127-1-ND/303037; ComponentKind: X7R; Value: 1 nF
C25 C40 C69 = Capacitor: Manufacturer: Yageo; Model: CC0805KKX7R8BB105; HelpURL: https://www.digikey.com/product-detail/en/yageo/CC0805KKX7R8BB105/311-1456-1-ND/2833762; ComponentKind: X7R; Value: 1 μF
C26 C27 C41-C43 C46 = TantalCap: Manufacturer: Vishay Sprague; Model: TR3C106K025C0300; HelpURL: https://www.digikey.com/product-detail/en/vishay-sprague/TR3C106K025C0300/718-1508-1-ND/1859983; ComponentKind: 25V; Value: 10 μF
C29 = Capacitor: Manufacturer: Yageo; Model: CC0805KKX7R7BB334; HelpURL: https://www.digikey.com/product-detail/en/yageo/CC0805KKX7R7BB334/311-1882-1-ND/5195784; ComponentKind: X7R; Value: 330 pF
C30-C33 = AlumCap: Manufacturer: EPCOS; Model: B43305B9687M000; HelpURL: https://www.digikey.com/products/en?keywords=B43305B9687M000; ComponentKind: 400V; Value: 680 μF
C44 C45 C47 C48 C60 C61 = Capacitor: Manufacturer: Yageo; Model: CC1206MKX5R7BB226; HelpURL: https://www.digikey.com/product-detail/en/yageo/CC1206MKX5R7BB226/311-1997-1-ND/5195899; ComponentKind: X5R; Value: 22 μF
C51 C52 C54 C55 = Capacitor: Manufacturer: Yageo; Model: CC1206KKX5R9BB106; HelpURL: https://www.digikey.com/product-detail/en/yageo/CC1206KKX5R9BB106/311-3449-1-ND/7164470; ComponentKind: X5R; Value: 10 μF
C53 C56 = Capacitor: Manufacturer: Yageo; Model: CC0805KRX7R9BB223; HelpURL: https://www.digikey.com/product-detail/en/yageo/CC0805KRX7R9BB223/311-1138-1-ND/303048; ComponentKind: X7R; Value: 22 nF
C57-C59 C62 = Capacitor: Manufacturer: Yageo; Model: CC0805KRX7R9BB221; HelpURL: https://www.digikey.com/product-detail/en/yageo/CC0805KRX7R9BB221/311-1123-1-ND/303033; ComponentKind: X7R; Value: 220 pF
C63 = Capacitor: Manufacturer: EPCOS (TDK); Model: B32021A3472M; HelpURL: https://www.digikey.com/product-detail/en/epcos-tdk/B32021A3472M000/495-4082-ND/2045205; Value: 4.7 nF
C64 = Capacitor: Manufacturer: Yageo; Model: CC0805KKX5R7BB106; HelpURL: https://www.digikey.com/product-detail/en/yageo/CC0805KKX5R7BB106/311-1865-1-ND/5195767; ComponentKind: X5R; Value: 10 μF
D1 D2 D6 D15 D16 = MCP6541T: Comparator; Manufacturer: Microchip Technology; Model: MCP6541T-I/OT; ComponentKind: SOT-23; HelpURL: https://www.digikey.com/product-detail/en/microchip-technology/MCP6541T-I-OT/MCP6541T-I-OTCT-ND/3622387
D3 D7 = MCP6001T: OP amplifier; Manufacturer: Microchip Technology; Model: MCP6001T-I/OT; HelpURL: https://www.digikey.com/product-detail/en/microchip-technology/MCP6001T-I-OT/MCP6001T-I-OTCT-ND/697158; ComponentKind: SOT23-5
D4 D8 = IR25750LTRPBF: Sensor; Manufacturer: Infineon Technologies; Model: IR25750LTRPBF; ComponentKind: SOT23-5; HelpURL: https://www.digikey.com/product-detail/en/infineon-technologies/IR25750LTRPBF/IR25750LTRPBFCT-ND/4743688
D5 D9 = UCC27322D: Low driver; Manufacturer: Texas Instruments; Model: UCC27322D; HelpURL: https://www.digikey.com/product-detail/en/texas-instruments/UCC37322D/296-13687-5-ND/509719; ComponentKind: 8-SOIC
D10 D11 = L5973AD: Step-down; Manufacturer: STMicroelectronics; Model: L5973AD; HelpURL: https://www.digikey.com/product-detail/en/stmicroelectronics/L5973AD/497-4565-5-ND/585938; ComponentKind: 8-SOIC
D12 = NCP1117LPST50T3G: LDO; Manufacturer: ON Semiconductor; Model: NCP1117ST50T3G; HelpURL: https://www.digikey.com/product-detail/en/on-semiconductor/NCP1117ST50T3G/NCP1117ST50T3GOSCT-ND/1967217; ComponentKind: SOT-223
D13 = TMA-0505S: Isolator DC; Manufacturer: Traco Power; Model: TMA-0505S; ComponentKind: 1W; HelpURL: https://www.chipdip.ru/product/tma0505s
D14 = TL598CDR: PWM; Manufacturer: Texas Instruments; Model: TL598CDR; HelpURL: https://www.digikey.com/product-detail/en/texas-instruments/TL598CDR/296-36983-1-ND/4428929; ComponentKind: 16-SOIC
FB1 = Inductor: Manufacturer: Murata Electronics North America; Model: BLM21PG121SN1D; HelpURL: https://www.digikey.com/product-detail/en/murata-electronics-north-america/BLM21PG121SN1D/490-5986-1-ND/3845186; ComponentKind: 0805; Value: 120R
L1 = Inductor ring: Manufacturer: Magnetics; Model: 0077439A7; Value: 500 μH; ComponentKind: 60 μ; HelpURL: http://ferrite.ru/warehouse/r-46-724-118-77439-a7.html
L2 L3 = Inductor: Manufacturer: Bourns Inc.; Model: SDR0604-220YL; HelpURL: https://www.digikey.com/product-detail/en/bourns-inc/SDR0604-220YL/SDR0604-220YLCT-ND/2127110; ComponentKind: SDR0604; Value: 22 μH
R1 = Resistor: Manufacturer: Yageo; Model: RC0805FR-075K6L; HelpURL: https://www.digikey.com/product-detail/en/yageo/RC0805FR-075K6L/311-5.60KCRCT-ND/730949; Value: 5k6
R2 = Resistor: Manufacturer: Yageo; Model: RC0805FR-07100KL; HelpURL: https://www.digikey.com/product-detail/en/yageo/RC0805FR-07100KL/311-100KCRCT-ND/730491; Value: 100k
R3 R12 R13 R22 R41 R42 R49 R67 R69 = Resistor: Manufacturer: Yageo; Model: RC0805JR-07100RL; HelpURL: https://www.digikey.com/product-detail/en/yageo/RC0805JR-07100RL/311-100ARCT-ND/731185; ComponentKind: 0805; Value: 100R
R4 R8 R11 R35 R36 R40 = Resistor: Manufacturer: Yageo; Model: RC0805FR-0710KL; HelpURL: https://www.digikey.com/product-detail/en/yageo/RC0805FR-0710KL/311-10.0KCRCT-ND/730482; Value: 10k
R5 = Resistor: Manufacturer: Yageo; Model: RC0805FR-073K3L; HelpURL: https://www.digikey.com/product-detail/en/yageo/RC0805FR-073K3L/311-3.30KCRCT-ND/730760; Value: 3k3
R6 R33 = Resistor: Manufacturer: Yageo; Model: RC0805FR-0713KL; HelpURL: https://www.digikey.com/product-detail/en/yageo/RC0805FR-0713KL/311-13.0KCRCT-ND/730531; Value: 13k
R7 R9 R32 R34 R38 R66 R68 R80-R82 = Resistor: Manufacturer: Yageo; Model: RC0805JR-071KL; HelpURL: https://www.digikey.com/product-detail/en/yageo/RC0805JR-071KL/311-1.0KARCT-ND/731165; ComponentKind: 0805; Value: 1k
R10 R39 R64 R65 = Resistor: Manufacturer: Yageo; Model: RC0805FR-071KL; HelpURL: https://www.digikey.com/product-detail/en/yageo/RC0805FR-071KL/311-1.00KCRCT-ND/730391; Value: 1k
R14 R23 = Resistor: Manufacturer: Yageo; Model: RC0805FR-07510KL; HelpURL: https://www.digikey.com/product-detail/en/yageo/RC0805FR-07510KL/311-510KCRCT-ND/730964; Value: 510k
R15 = Resistor: Manufacturer: Yageo; Model: RC0805JR-07220RL; HelpURL: https://www.digikey.com/product-detail/en/yageo/RC0805JR-07220RL/311-220ARCT-ND/731230; ComponentKind: 0805; Value: 220R
R16-R21 R43 R44 R46-R48 = Resistor: Manufacturer: Yageo; Model: RC0805FR-075R1L; HelpURL: https://www.digikey.com/product-detail/en/yageo/RC0805FR-075R1L/YAG3373CT-ND/5962195; ComponentKind: 0805; Value: 5R1
R24-R31 R50-R56 R63 R72 R73 R76 R77 R79 = Resistor: Manufacturer: Yageo; Model: RC0805JR-0710KL; HelpURL: https://www.digikey.com/product-detail/en/yageo/RC0805JR-0710KL/311-10KARCT-ND/731188; ComponentKind: 0805; Value: 10k
R37 R74 R75 = ADJ resistor: Manufacturer: Bourns Inc.; Model: 3296W-1-103LF; HelpURL: https://www.digikey.com/product-detail/en/bourns-inc/3296W-1-103LF/3296W-103LF-ND/1088045; ComponentKind: 3296W; Value: 10k
R45 = Resistor: Manufacturer: Yageo; Model: RC0805JR-072R2L; HelpURL: https://www.digikey.com/product-detail/en/yageo/RC0805JR-072R2L/311-2.2ARCT-ND/731217; ComponentKind: 0805; Value: 2R2
R57 = Resistor: Manufacturer: Yageo; Model: RC0805FR-0743KL; HelpURL: https://www.digikey.com/product-detail/en/yageo/RC0805FR-0743KL/311-43.0KCRCT-ND/730900; Value: 43k
R58 = Resistor: Manufacturer: Yageo; Model: RC0805FR-0720KL; HelpURL: https://www.digikey.com/product-detail/en/yageo/RC0805FR-0720KL/311-20.0KCRCT-ND/730667; Value: 20k
R59-R62 R70 R71 R78 = Resistor: Manufacturer: Yageo; Model: RC0805FR-074K7L; HelpURL: https://www.digikey.com/product-detail/en/yageo/RC0805FR-074K7L/311-4.70KCRCT-ND/730876; Value: 4k7
R83 = Resistor: Manufacturer: Yageo; Model: RC2512JK-07150KL; HelpURL: https://www.digikey.com/products/en?keywords=RC2512JK-07150KL%20; ComponentKind: 2512; Value: 220k
T1 T2 = Push-Pull: Impulse; Manufacturer: Epcos; Model: ETD59/31/22; HelpURL: http://ferrite.ru/warehouse/etd-59-31-22-serdechnik-b66397g0000x187.html; ComponentKind: N87
U1 = Optoisolator: Manufacturer: Lite-On Inc.; Model: LTV-817S; HelpURL: https://www.digikey.com/product-detail/en/lite-on-inc/LTV-817S/160-1367-5-ND/385837; ComponentKind: 4-SMD
VD1 VD3 VD4 VD28 VD29 = Diod Zener: Manufacturer: Fairchild/ON Semiconductor
  VD1: ComponentKind: SOD-123; Model: MMSZ5231B; HelpURL: https://www.digikey.com/product-detail/en/fairchild-on-semiconductor/MMSZ5231B/MMSZ5231BFSCT-ND/2053137
  VD3 VD4 VD28 VD29: ComponentKind: SMB; Model: SMBJ40A; HelpURL: https://www.digikey.com/product-detail/en/fairchild-on-semiconductor/SMBJ40A/SMBJ40AFSTR-ND/1049528
VD2 VD5-VD10 VD12 VD27 VD30-VD35 VD37 = Diod Schottky: Manufacturer: Fairchild/ON Semiconductor; ComponentKind: SOD-123F; Model: SS24FL; HelpURL: https://www.digikey.com/product-detail/en/fairchild-on-semiconductor/SS24FL/SS24FLCT-ND/5305093
VD11 VD13-VD17 VD36 VD38-VD42 = TVS-diod: Manufacturer: Littelfuse Inc.; Model: SD15C-01FTG; ComponentKind: SOD-323; HelpURL: https://www.digikey.com/product-detail/en/littelfuse-inc/SD15C-01FTG/F6444CT-ND/5019598
VD18-VD21 VD23-VD26 = Diod: Manufacturer: Infineon Technologies; ComponentKind: TO-220AC; Model: HFA15TB60PBF; HelpURL: https://www.digikey.com/product-detail/en/infineon-technologies/HFA15TB60PBF/IRHFA15TB60PBF-ND/5180758
VD22 = Program Zener: Manufacturer: Texas Instruments; ComponentKind: SOT-23; Model: TL431AIDBZR; HelpURL: https://www.digikey.com/product-detail/en/texas-instruments/ATL431AIDBZR/296-42083-1-ND/5252836
VD43 VD44 = Diod Schottky: Manufacturer: STMicroelectronics; ComponentKind: SMA; Model: STPS2L60A; HelpURL: https://www.digikey.com/product-detail/en/stmicroelectronics/STPS2L60A/497-2461-1-ND/603843
VD45 = LED: Manufacturer: Wurth Electronics Inc.; Model: 150080RS75000; HelpURL: https://www.digikey.com/product-detail/en/wurth-electronics-inc/150080RS75000/732-4984-1-ND/4489916; ComponentKind: 0805; Value: RED
VD46 VD47 = LED: Manufacturer: Wurth Electronics Inc.; Model: 150080VS75000; HelpURL: https://www.digikey.com/product-detail/en/wurth-electronics-inc/150080VS75000/732-4986-1-ND/4489922; ComponentKind: 0805; Value: GREEN
VT1-VT12 = N-chanel: Mosfet; Manufacturer: Infineon Technologies; Model: IPP083N10N5AKSA1; ComponentKind: TO-220; HelpURL: https://www.digikey.com/product-detail/en/infineon-technologies/IPP083N10N5AKSA1/IPP083N10N5AKSA1-ND/5960342
VT13 VT16 = PNP: Bipolar; Manufacturer: ON Semiconductor; Model: BC857BLT1G; ComponentKind: PNP; HelpURL: https://www.digikey.com/product-detail/en/on-semiconductor/BC857BLT1G/BC857BLT1GOSCT-ND/917843
VT14 VT15 = N-chanel: Mosfet; Manufacturer: Infineon Technologies; Model: IRLML0030TRPBF; ComponentKind: SOT-23; HelpURL: https://www.digikey.com/product-detail/en/infineon-technologies/IRLML0030TRPBF/IRLML0030TRPBFCT-ND/2202231
X1 X2 = 1-Connector: Manufacturer: Wurth Electronics Inc.; Model: 7461383; HelpURL: https://www.digikey.com/products/en?keywords=7461383; ComponentKind: 160А
X3-X6 = 2-Connector: Model: WF-02; Manufacturer: *; HelpURL: *; ComponentKind: *
X7 = 2-Connector: Manufacturer: Ningbo; Model: X977B02; HelpURL: https://www.chipdip.ru/product/x977b02; ComponentKind: 10А